# EAGLE schematic shield_schematic (EAGLE 6.4)
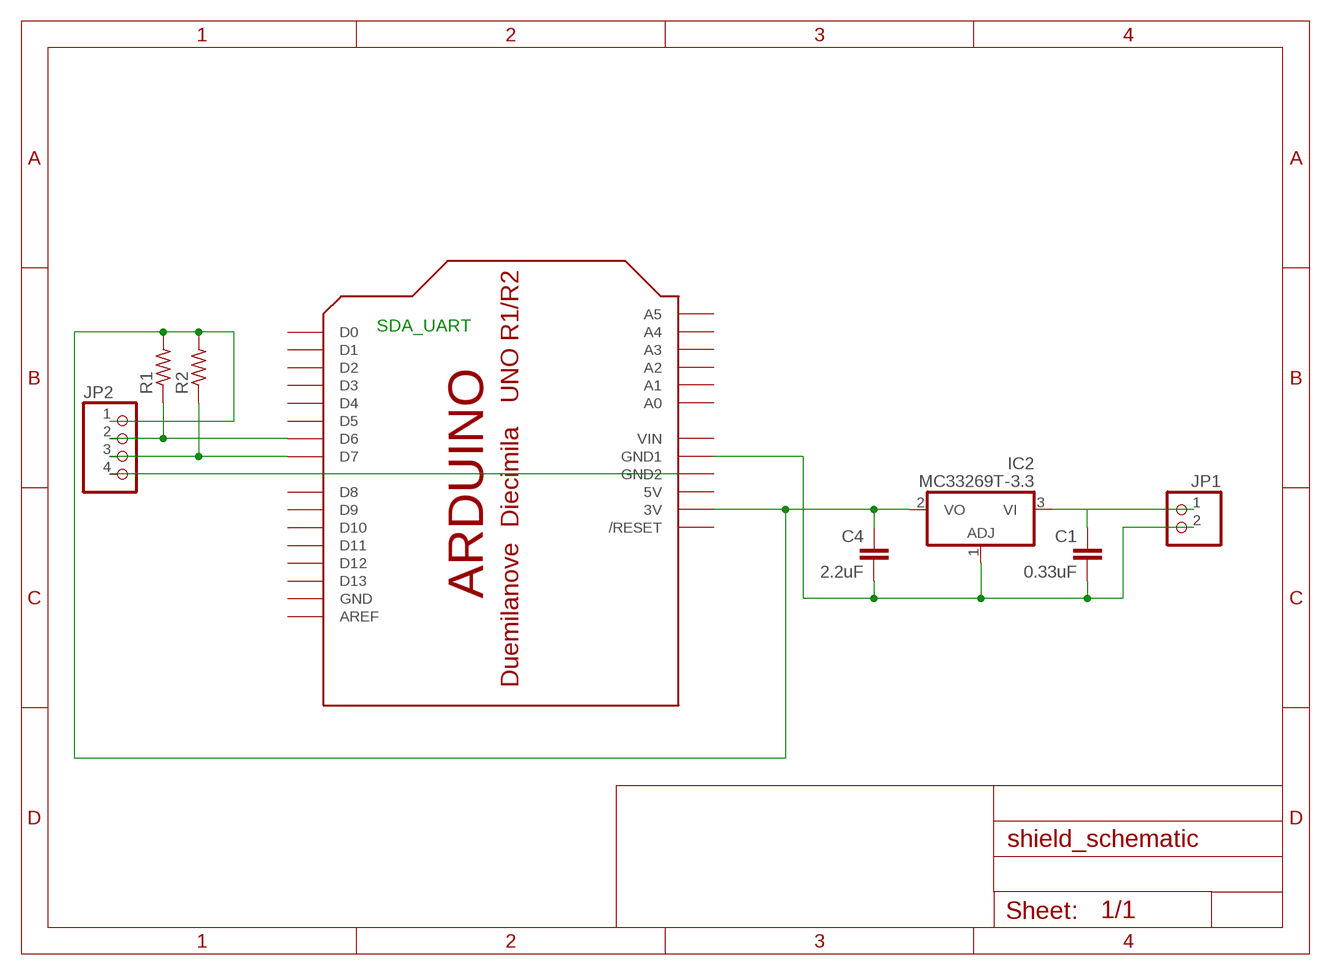
[diagram p0: schematic, sheet 1]

## Parts
C1  0.33uF  C5/2.5  [C5B2.5]
C4  2.2uF  C5/2.5  [C5B2.5]
IC2  MC33269T-3.3  [TO220V]
JP1  PINHD-1X2  [1X02]
JP2  PINHD-1X4  [1X04]
R1  R-US_0204/7  [0204/7]
R2  R-US_0204/7  [0204/7]
U$1  ARDUINO-BPLACE  [ARDUINO-BPLACE]

## Nets
N$1: C1.1 IC2.3(VI) JP1.1
N$2: C1.2 C4.2 IC2.1(ADJ) JP1.2 U$1.GND1
N$4: C4.1 IC2.2(VO) JP2.1 R1.2 R2.2 U$1.3V
N$5: JP2.2 R1.1 U$1.D6
N$6: JP2.3 R2.1 U$1.D7
N$7: JP2.4
Unconnected: U$1.A0 U$1.A1 U$1.A2 U$1.A3 U$1.A4 U$1.A5 U$1.AREF U$1.D0 U$1.D1 U$1.D2 U$1.D3 U$1.D4 U$1.D5 U$1.D8 U$1.D9 U$1.D10 U$1.D11 U$1.D12 U$1.D13 U$1.RESET(/RESET)

## Notes on the sheet
- SDA_UART

## Power pins joined to a net without a drawn wire
5V: U$1.5V
GND: U$1.GND
GND2: U$1.GND2
VIN: U$1.VIN

## Library data of the parts
C1 C4 = capacitor-wima:C: CAPACITOR naming: grid - package width
IC2 = linear:MC33269?*: Adjustable Output Low Dropout Voltage Regulator 800 mA Source: http://www.onsemi.com/pub/Collateral/MC33269-D.PDF
JP1 = pinhead:PINHD-1X2: PIN HEADER
JP2 = pinhead:PINHD-1X4: PIN HEADER
R1 R2 = resistor:R-US_: RESISTOR, American symbol
U$1 = adafruit:ARDUINO: Arduino Diecimila/Duemilanove Make a shield with ease, this package has all the named pins as well as the two mounting drill holes and an outline of the USB and DC power connector. The outline is on the DIMENSION layer, so if your board house uses it they will cut the outline to match. http://www.ladyada.net/library/pcb/eaglelibrary.html